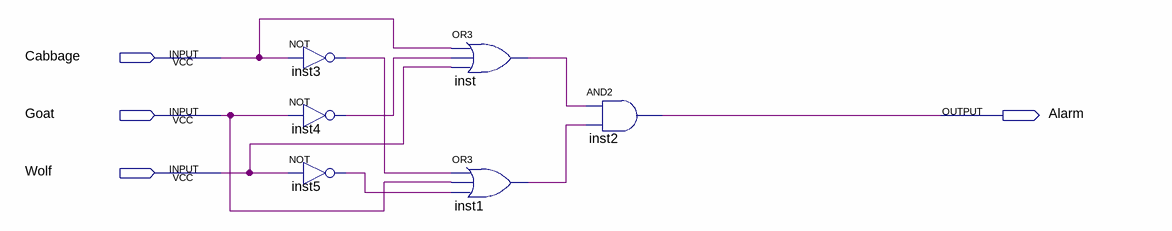
[diagram p0: schematic sheet]
// Quartus schematic lab3step0.bdf as structural Verilog: 6 symbols, 4 pins
module lab3step0 (
  input  Cabbage,
  input  Goat,
  input  Wolf,
  output Alarm
);

  wire inst1_out, inst3_out, inst4_out, inst5_out, inst_out;

  not inst3 (inst3_out, Cabbage);
  not inst4 (inst4_out, Goat);
  not inst5 (inst5_out, Wolf);
  or inst (inst_out, Cabbage, inst4_out, Wolf);
  or inst1 (inst1_out, inst3_out, Goat, inst5_out);
  and inst2 (Alarm, inst_out, inst1_out);
endmodule
